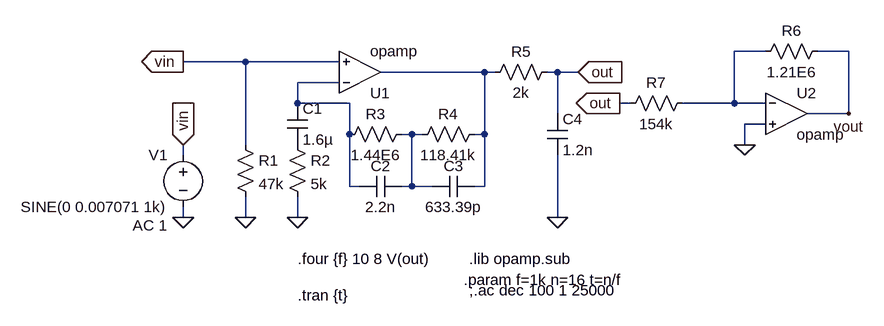
[diagram p0: schematic riaa.asc]
riaa.asc, the LTspice schematic file:
Version 4
SHEET 1 1580 680
WIRE 880 16 832 16
WIRE 1008 16 960 16
WIRE 80 32 -16 32
WIRE 224 32 80 32
WIRE 448 48 288 48
WIRE 464 48 448 48
WIRE 560 48 544 48
WIRE 592 48 560 48
WIRE 224 64 160 64
WIRE 160 96 160 64
WIRE 240 96 160 96
WIRE 672 96 656 96
WIRE 832 96 832 16
WIRE 832 96 752 96
WIRE 880 96 832 96
WIRE 560 112 560 48
WIRE 1008 112 1008 16
WIRE 1008 112 944 112
WIRE 880 128 848 128
WIRE 240 144 240 96
WIRE 336 144 320 144
WIRE 352 144 336 144
WIRE 448 144 448 48
WIRE 448 144 432 144
WIRE 80 160 80 32
WIRE 848 160 848 128
WIRE -16 176 -16 160
WIRE 240 224 240 144
WIRE 256 224 240 224
WIRE 336 224 336 144
WIRE 336 224 320 224
WIRE 368 224 336 224
WIRE 448 224 448 144
WIRE 448 224 432 224
WIRE -16 272 -16 256
WIRE 80 272 80 240
WIRE 160 272 160 240
WIRE 560 272 560 176
FLAG 160 272 0
FLAG -16 272 0
FLAG -16 160 vin
IOPIN -16 160 In
FLAG -16 32 vin
IOPIN -16 32 Out
FLAG 80 272 0
FLAG 560 272 0
FLAG 656 96 out
IOPIN 656 96 Out
FLAG 848 160 0
FLAG 1008 112 vout
FLAG 592 48 out
IOPIN 592 48 In
SYMBOL res 144 144 R0
SYMATTR InstName R2
SYMATTR Value 5k
SYMBOL OpAmps\\opamp 256 112 M180
SYMATTR InstName U1
SYMBOL res 336 128 R90
WINDOW 0 0 56 VBottom 2
WINDOW 3 32 56 VTop 2
SYMATTR InstName R3
SYMATTR Value 1.44E6
SYMBOL res 448 128 R90
WINDOW 0 0 56 VBottom 2
WINDOW 3 32 56 VTop 2
SYMATTR InstName R4
SYMATTR Value 118.41k
SYMBOL cap 320 208 R90
WINDOW 0 0 32 VBottom 2
WINDOW 3 32 32 VTop 2
SYMATTR InstName C2
SYMATTR Value 2.2n
SYMBOL cap 432 208 R90
WINDOW 0 0 32 VBottom 2
WINDOW 3 32 32 VTop 2
SYMATTR InstName C3
SYMATTR Value 633.39p
SYMBOL voltage -16 160 M0
WINDOW 123 24 124 Left 2
WINDOW 39 0 0 Left 0
SYMATTR Value2 AC 1
SYMATTR InstName V1
SYMATTR Value SINE(0 0.007071 1k)
SYMBOL res 64 144 R0
SYMATTR InstName R1
SYMATTR Value 47k
SYMBOL cap 144 96 R0
SYMATTR InstName C1
SYMATTR Value 1.6µ
SYMBOL res 448 64 R270
WINDOW 0 32 56 VTop 2
WINDOW 3 0 56 VBottom 2
SYMATTR InstName R5
SYMATTR Value 2k
SYMBOL cap 544 112 R0
SYMATTR InstName C4
SYMATTR Value 1.2n
SYMBOL OpAmps\\opamp 912 48 R0
SYMATTR InstName U2
SYMBOL res 976 0 R90
WINDOW 0 0 56 VBottom 2
WINDOW 3 32 56 VTop 2
SYMATTR InstName R6
SYMATTR Value 1.21E6
SYMBOL res 768 80 R90
WINDOW 0 0 56 VBottom 2
WINDOW 3 32 56 VTop 2
SYMATTR InstName R7
SYMATTR Value 154k
TEXT 424 336 Left 2 !.lib opamp.sub
TEXT 160 336 Left 2 !.four {f} 10 8 V(out)
TEXT 416 368 Left 2 !.param f=1k n=16 t=n/f
TEXT 424 384 Left 2 !;.ac dec 100 1 25000
TEXT 160 392 Left 2 !.tran {t}

The netlist it stands for:
* riaa.asc
R2 P001 0 5k
XU1 N003 vin N002 opamp Aol=100K GBW=10Meg  ; pins invin noninvin out
R3 N004 N003 1.44E6
R4 N002 N004 118.41k
C2 N004 N003 2.2n
C3 N002 N004 633.39p
V1 vin 0 SINE(0 0.007071 1k) AC 1
R1 vin 0 47k
C1 N003 P001 1.6µ
R5 N002 out 2k
C4 out 0 1.2n
XU2 N001 0 vout opamp Aol=100K GBW=10Meg  ; pins invin noninvin out
R6 vout N001 1.21E6
R7 N001 out 154k
.lib opamp.sub
.four {f} 10 8 V(out)
.param f=1k n=16 t=n/f
;.ac dec 100 1 25000
.tran {t}
.backanno
.end